# EAGLE design TheBallClock (EAGLE 6.6.0)
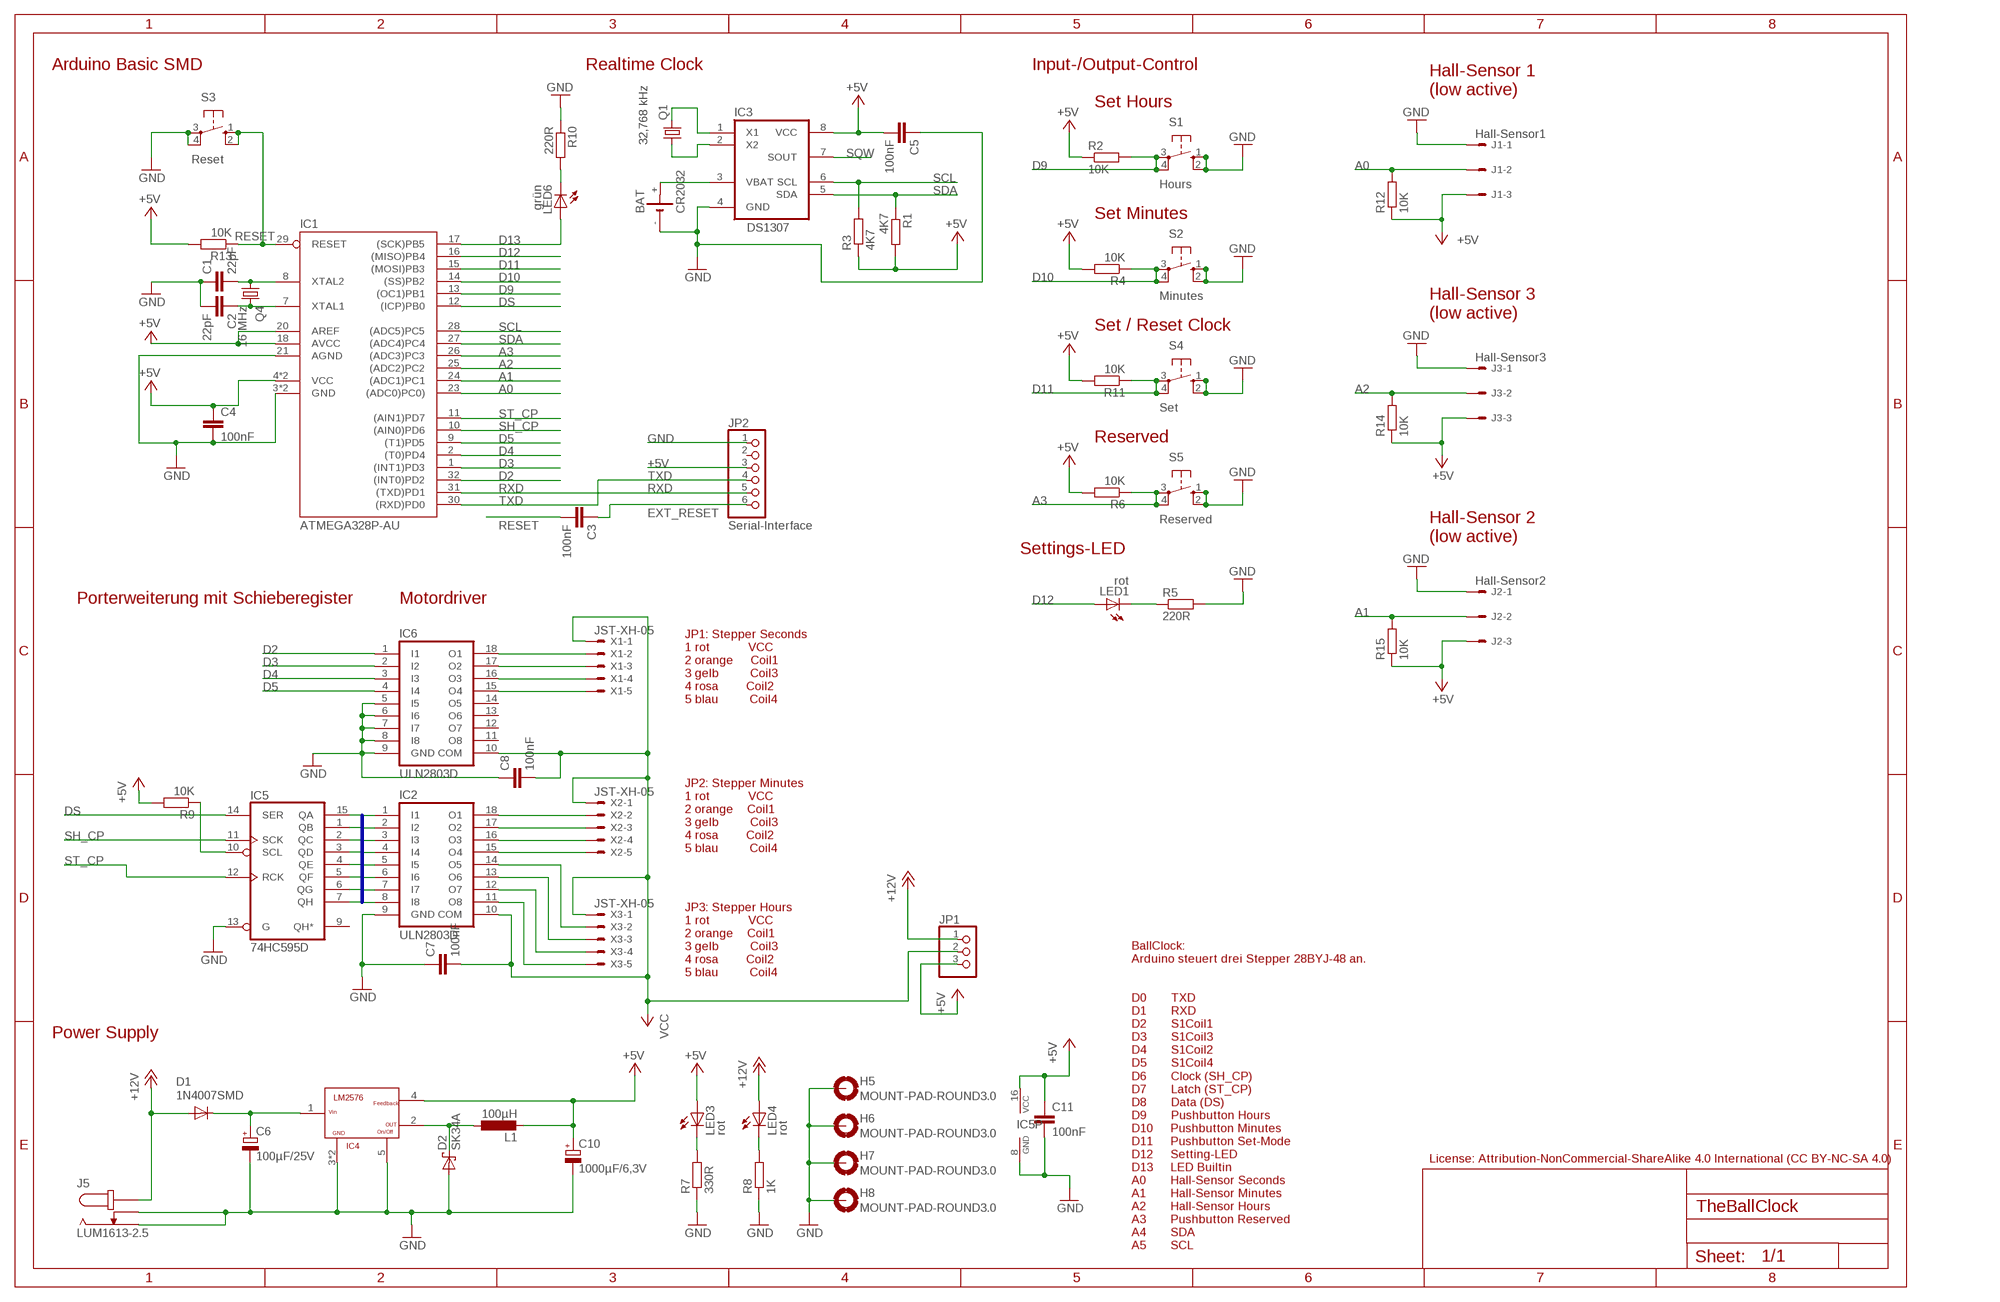
[diagram p0: schematic, sheet 1]

## Parts
BAT  CR2032  BATTERIEHALTER_KZH20  [KZH20-SMD]
C1  22pF  C-EUC0805K  [C0805K]
C2  22pF  C-EUC0805K  [C0805K]
C3  100nF  C-EUC0805  [C0805]
C4  100nF  C-EUC0805  [C0805]
C5  100nF  C-EUC0805  [C0805]
C6  100µF/25V  CPOL-EUF  [PANASONIC_F]
C7  100nF  C-EUC0805  [C0805]
C8  100nF  C-EUC0805  [C0805]
C10  1000µF/6,3V  CPOL-EUG  [PANASONIC_G]
C11  100nF  C-EUC0805  [C0805]
D1  1N4007SMD  DIODE-SMB  [SMB]
D2  SK34A  [DO214AC]
H5  MOUNT-PAD-ROUND3.0  [3,0-PAD]
H6  MOUNT-PAD-ROUND3.0  [3,0-PAD]
H7  MOUNT-PAD-ROUND3.0  [3,0-PAD]
H8  MOUNT-PAD-ROUND3.0  [3,0-PAD]
IC1  ATMEGA328P-AU  [TQFP32-08]
IC2  ULN2803D  [SO18W]
IC3  DS1307  DS1307Z  [SO08]
IC4  LM2576  [TO263-5]
IC5  74HC595D  [SO16]
IC6  ULN2803D  [SO18W]
J1  Hall-Sensor1  22-27-2031-03  [6410-03]
J2  Hall-Sensor2  22-27-2031-03  [6410-03]
J3  Hall-Sensor3  22-27-2031-03  [6410-03]
J5  LUM1613-2.5  [LUM_DS_1613_15]
JP1  PINHD-1X3  [1X03]
JP2  Serial-Interface  PINHD-1X6  [1X06]
L1  100µH  L-EUPISM  [PISM]
LED1  rot  LEDCHIPLED_0805  [CHIPLED_0805]
LED3  rot  LEDCHIPLED_0805  [CHIPLED_0805]
LED4  rot  LEDCHIPLED_0805  [CHIPLED_0805]
LED6  grün  LEDCHIPLED_0805  [CHIPLED_0805]
Q1  32,768 kHz  CRYSTALTC38H  [TC38H]
Q4  16 MHz  CRYSTALHC49UP  [HC49UP]
R1  4K7  R-EU_R0805  [R0805]
R2  10K  R-EU_M0805  [M0805]
R3  4K7  R-EU_R0805  [R0805]
R4  10K  R-EU_M0805  [M0805]
R5  220R  R-EU_R0805  [R0805]
R6  10K  R-EU_M0805  [M0805]
R7  330R  R-EU_R0805  [R0805]
R8  1K  R-EU_R0805  [R0805]
R9  10K  R-EU_R0805  [R0805]
R10  220R  R-EU_R0805  [R0805]
R11  10K  R-EU_M0805  [M0805]
R12  10K  R-EU_M0805  [M0805]
R13  10K  R-EU_M0805  [M0805]
R14  10K  R-EU_M0805  [M0805]
R15  10K  R-EU_M0805  [M0805]
S1  Hours  10-XX  [B3F-10XX]
S2  Minutes  10-XX  [B3F-10XX]
S3  Reset  10-XX  [B3F-10XX]
S4  Set  10-XX  [B3F-10XX]
S5  Reserved  10-XX  [B3F-10XX]
X1  JST-XH-05  JST-XH-05-PIN-LONG-PAD  [JST-XH-05-PACKAGE-LONG-PAD]
X2  JST-XH-05  JST-XH-05-PIN-LONG-PAD  [JST-XH-05-PACKAGE-LONG-PAD]
X3  JST-XH-05  JST-XH-05-PIN-LONG-PAD  [JST-XH-05-PACKAGE-LONG-PAD]

## Nets
+5V [power]: C4.1 C5.2 C10.+ C11.1 IC1.4(VCC) IC1.6(VCC) IC1.18(AVCC) IC1.20(AREF) IC3.8(VCC) IC4.4(FEEDBACK) IC5.16(VCC) J1.3 J2.3 J3.3 JP1.3 JP2.3 L1.2 LED3.A R1.2 R2.1 R3.1 R4.2 R6.2 R9.2 R11.2 R12.1 R13.2 R14.1 R15.1
+12V: D1.A J5.3A J5.3B JP1.1 LED4.A
A0: IC1.23((ADC0)PC0)) J1.2 R12.2
A1: IC1.24((ADC1)PC1) J2.2 R15.2
A2: IC1.25((ADC2)PC2) J3.2 R14.2
A3: IC1.26((ADC3)PC3) R6.1 S5.3(P) S5.4(P1)
BUS1: IC2.1(I1) IC5.15(QA)
BUS2: IC2.2(I2) IC5.1(QB)
BUS3: IC2.3(I3) IC5.2(QC)
BUS4: IC2.4(I4) IC5.3(QD)
BUS5: IC2.5(I5) IC5.4(QE)
BUS6: IC2.6(I6) IC5.5(QF)
BUS7: IC2.7(I7) IC5.6(QG)
BUS8: IC2.8(I8) IC5.7(QH)
D2: IC1.32((INT0)PD2) IC6.1(I1)
D3: IC1.1((INT1)PD3) IC6.2(I2)
D4: IC1.2((T0)PD4) IC6.3(I3)
D5: IC1.9((T1)PD5) IC6.4(I4)
D9: IC1.13((OC1)PB1) R2.2 S1.3(P) S1.4(P1)
D10: IC1.14((SS)PB2) R4.1 S2.3(P) S2.4(P1)
D11: IC1.15((MOSI)PB3) R11.1 S4.3(P) S4.4(P1)
D12: IC1.16((MISO)PB4) LED1.A
D13: IC1.17((SCK)PB5) LED6.A
DS: IC1.12((ICP)PB0) IC5.14(SER)
EXT_RESET: C3.1 JP2.6
GND [gnd]: BAT.- C1.1 C2.2 C4.2 C5.1 C6.- C7.1 C8.1 C10.- C11.2 D2.A H5.B3,0(MOUNT) H6.B3,0(MOUNT) H7.B3,0(MOUNT) H8.B3,0(MOUNT) IC1.3(GND) IC1.5(GND) IC1.21(AGND) IC2.9(GND) IC3.4(GND) IC4.3(GND) IC4.5(ON/OFF) IC4.6(GND) IC5.8(GND) IC5.13(G) IC6.5(I5) IC6.6(I6) IC6.7(I7) IC6.8(I8) IC6.9(GND) J1.1 J2.1 J3.1 J5.1 J5.2 JP2.1 R5.2 R7.1 R8.1 R10.1 S1.1(S) S1.2(S1) S2.1(S) S2.2(S1) S3.3(P) S3.4(P1) S4.1(S) S4.2(S1) S5.1(S) S5.2(S1)
N$1: LED1.C R5.1
N$2: BAT.+ IC3.3(VBAT)
N$3: D2.C IC4.2(OUTPUT) L1.1
N$4: LED3.C R7.2
N$5: LED4.C R8.2
N$6 [power]: C6.+ D1.C IC4.1(+VIN)
N$11: C1.2 IC1.8(XTAL2) Q4.1
N$12: IC2.18(O1) X2.2
N$13: C2.1 IC1.7(XTAL1) Q4.2
N$14: LED6.C R10.2
N$15: IC2.17(O2) X2.3
N$16: IC2.16(O3) X2.4
N$17: IC2.15(O4) X2.5
N$18: IC2.14(O5) X3.2
N$19: IC2.13(O6) X3.3
N$20: IC2.12(O7) X3.4
N$21: IC2.11(O8) X3.5
N$22: IC6.18(O1) X1.2
N$23: IC6.17(O2) X1.3
N$24: IC6.16(O3) X1.4
N$25: IC6.15(O4) X1.5
N$38: IC5.10(SCL) R9.1
N$227: IC3.1(X1) Q1.2
N$228: IC3.2(X2) Q1.1
RESET: C3.2 IC1.29(RESET) R13.1 S3.1(S) S3.2(S1)
RXD: IC1.31((TXD)PD1) JP2.5
SCL: IC1.28((ADC5)PC5) IC3.6(SCL) R3.2
SDA: IC1.27((ADC4)PC4) IC3.5(SDA) R1.1
SH_CP: IC1.10((AIN0)PD6) IC5.11(SCK)
SQW: IC3.7(SOUT)
ST_CP: IC1.11((AIN1)PD7) IC5.12(RCK)
TXD: IC1.30((RXD)PD0) JP2.4
VCC: C7.2 C8.2 IC2.10(COM) IC6.10(COM) JP1.2 X1.1 X2.1 X3.1
Unconnected: IC5.9(QH*) IC6.11(O8) IC6.12(O7) IC6.13(O6) IC6.14(O5) JP2.2

## Buses
BUS[1..8]

## Notes on the sheet
- Arduino Basic SMD | Realtime Clock | Input-/Output-Control
- Hall-Sensor 1
  (low active)
- Set Hours
- Set Minutes
- Hall-Sensor 3
  (low active)
- Set / Reset Clock
- Reserved
- Hall-Sensor 2
  (low active)
- Settings-LED
- Porterweiterung mit Schieberegister | Motordriver
- JP1: Stepper Seconds
  1 rot           VCC
  2 orange     Coil1
  3 gelb         Coil3
  4 rosa        Coil2
  5 blau         Coil4
- JP2: Stepper Minutes
  1 rot           VCC
  2 orange    Coil1
  3 gelb         Coil3
  4 rosa        Coil2
  5 blau         Coil4
- JP3: Stepper Hours
  1 rot           VCC
  2 orange    Coil1
  3 gelb         Coil3
  4 rosa        Coil2
  5 blau         Coil4
- Power Supply
- License: Attribution-NonCommercial-ShareAlike 4.0 International (CC BY-NC-SA 4.0)
- BallClock:
  Arduino steuert drei Stepper 28BYJ-48 an.
  
  
  D0       TXD
  D1       RXD
  D2       S1Coil1
  D3       S1Coil3
  D4       S1Coil2
  D5       S1Coil4
  D6       Clock (SH_CP)
  D7       Latch (ST_CP)
  D8       Data (DS)
  D9       Pushbutton Hours
  D10     Pushbutton Minutes
  D11     Pushbutton Set-Mode
  D12     Setting-LED
  D13     LED Builtin
  A0       Hall-Sensor Seconds
  A1       Hall-Sensor Minutes
  A2       Hall-Sensor Hours
  A3       Pushbutton Reserved     
  A4       SDA
  A5       SCL

## Library data of the parts
BAT = MyEagle_NEW:BATTERIEHALTER_KZH20: KZH 20 Batteriehalter BH KZH-20-1 Reichelt: https://www.reichelt.de/Batteriehalter-fuer-Knopfzellen/KZH-20-1/3/index.html?ACTION=3&LA=2&ARTICLE=44621&GROUPID=4260&artnr=KZH+20-1&SEARCH=%252A
C1-C5 C7 C8 C11 = resistor:C-EU: CAPACITOR, European symbol
C6 C10 = resistor:CPOL-EU: POLARIZED CAPACITOR, European symbol
D1 = diode:DIODE-: DIODE
D2 = MyEagle:SK34A
H5-H8 = holes:MOUNT-PAD-ROUND: MOUNTING PAD, round
IC1 = ATMega328:ATMEGA328P-: MICROCONTROLLER 4 Kbytes FLASH 128 bytes SRAM 256 bytes EEPROM UART 6-channel 10 bit ADC
IC2 IC6 = MyEagle:ULN2803: ULN2803 Darlington Arrays 8 Darlington Arrays
IC3 = MyEagle:DS1307: DS1307 64 x 8 Serial Real Time Clock
IC4 = MyEagle:LM2576: LM2576 3 A Step Down Voltage Regulator Datenblatt: https://www.mikrocontroller.net/part/LM2576
IC5 = 74xx-eu:74*595: 8-bit SHIFT REGISTER, output latch
J1-J3 = con-molex:22-?-03: CONNECTOR wire to board 2.54 mm (.1 inch) pitch header
J5 = MyEagle:LUM1613: Lumberg 1613 Netzgeräte-Einbaukupplung mit Öffner SMD Lumberg 1613-14: Durchmesser aussen: 6,5 mm Durchmesser Mittelstift: 2,0 mm Lumberg 1613-15: Durchmesser aussen: 6,5 mm Durchmesser Mittelstift: 2,5 mm Datenblatt: https://cdn-reichelt.de/documents/datenblatt/C160/DS_1613_14.pdf
JP1 = pinhead:PINHD-1X3: PIN HEADER
JP2 = pinhead:PINHD-1X6: PIN HEADER
L1 = Inductor-Fastron2:L-EU
LED1 LED3 LED4 LED6 = led:LED: LED OSRAM: - CHIPLED LG R971, LG N971, LY N971, LG Q971, LY Q971, LO R971, LY R971 LH N974, LH R974 LS Q976, LO Q976, LY Q976 LO Q996 - Hyper CHIPLED LW Q18S LB Q993, LB Q99A, LB R99A - SideLED LS A670, LO A670, LY A670, LG A670, LP A670 LB A673, LV A673, LT A673, LW A673 LH A674 LY A675 LS A676, LA A676, LO A676, LY A676, LW A676 LS A679, LY A679, LG A679 - Hyper Micro SIDELED® LS Y876, LA Y876, LO Y876, LY Y876 LT Y87S - SmartLED LW L88C, LW L88S LB L89C, LB L89S, LG L890 LS L89K, LO L89K, LY L89K LS L896, LA L896, LO L896, LY L896 - TOPLED LS T670, LO T670, LY T670, LG T670, LP T670 LSG T670, LSP T670, LSY T670, LOP T670, LYG T670 LG T671, LOG T671, LSG T671 LB T673, LV T673, LT T673, LW T673 LH T674 LS T676, LA T676, LO T676, LY T676, LB T676, LH T676, LSB T676, LW T676 LB T67C, LV T67C, LT T67C, LS T67K, LO T67K, LY T67K, LW E67C LS E67B, LA E67B, LO E67B, LY E67B, LB E67C, LV E67C, LT E67C LW T67C LS T679, LY T679, LG T679 LS T770, LO T770, LY T770, LG T770, LP T770 LB T773, LV T773, LT T773, LW T773 LH T774 LS E675, LA E675, LY E675, LS T675 LS T776, LA T776, LO T776, LY T776, LB T776 LHGB T686 LT T68C, LB T68C - Hyper Mini TOPLED® LB M676 - Mini TOPLED Santana® LG M470 LS M47K, LO M47K, LY M47K Source: http://www.osram.convergy.de LUXEON: - LUMILED® LXK2-PW12-R00, LXK2-PW12-S00, LXK2-PW14-U00, LXK2-PW14-V00 LXK2-PM12-R00, LXK2-PM12-S00, LXK2-PM14-U00 LXK2-PE12-Q00, LXK2-PE12-R00, LXK2-PE12-S00, LXK2-PE14-T00, LXK2-PE14-U00 LXK2-PB12-K00, LXK2-PB12-L00, LXK2-PB12-M00, LXK2-PB14-N00, LXK2-PB14-P00, LXK2-PB14-Q00 LXK2-PR12-L00, LXK2-PR12-M00, LXK2-PR14-Q00, LXK2-PR14-R00 LXK2-PD12-Q00, LXK2-PD12-R00, LXK2-PD12-S00 LXK2-PH12-R00, LXK2-PH12-S00 LXK2-PL12-P00, LXK2-PL12-Q00, LXK2-PL12-R00 Source: www.luxeon.com KINGBRIGHT: KA-3528ASYC Source: www.kingbright.com
Q1 = MyEagle:CRYSTAL: CRYSTAL; OC_FARNELL: unknown; OC_NEWARK: unknown
Q4 = crystal:CRYSTAL: CRYSTAL; OC_FARNELL: unknown; OC_NEWARK: unknown
R1-R15 = resistor:R-EU_: RESISTOR, European symbol
S1-S5 = switch-omron:10-XX: OMRON SWITCH; MPN: B3F-1000; OC_FARNELL: 176432; OC_NEWARK: 36M3542
X1-X3 = con-jst XH Connectors v1-0:JST-XH-05-PIN: JST XH Connector 2 Pin Wire to board connector. Pitch: 2,54 mm, (0.100") Number of pins: 5 Created by Rembrandt Electronics www.rembrandtelectronics.com

## Net classes
1 power: width 0.61 mm, drill 0.61 mm, clearance 0.254 mm
2 gnd: width 0.61 mm, drill 0.559 mm, clearance 0.254 mm

## Board
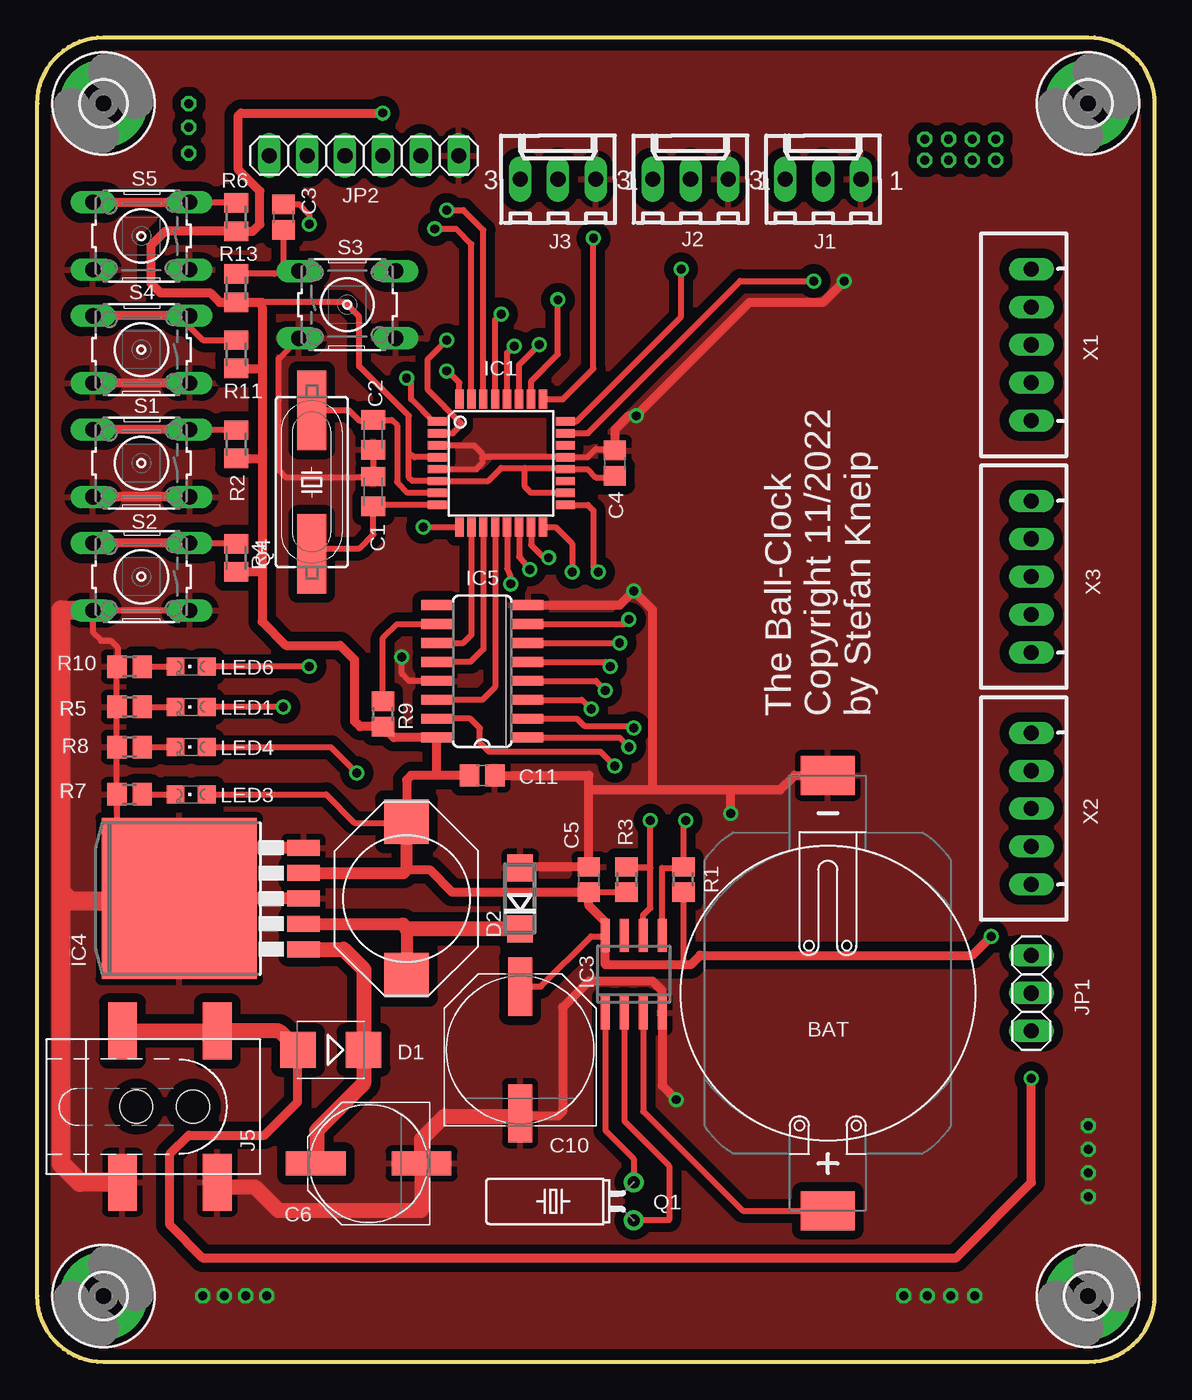
[diagram p1: board, top side]
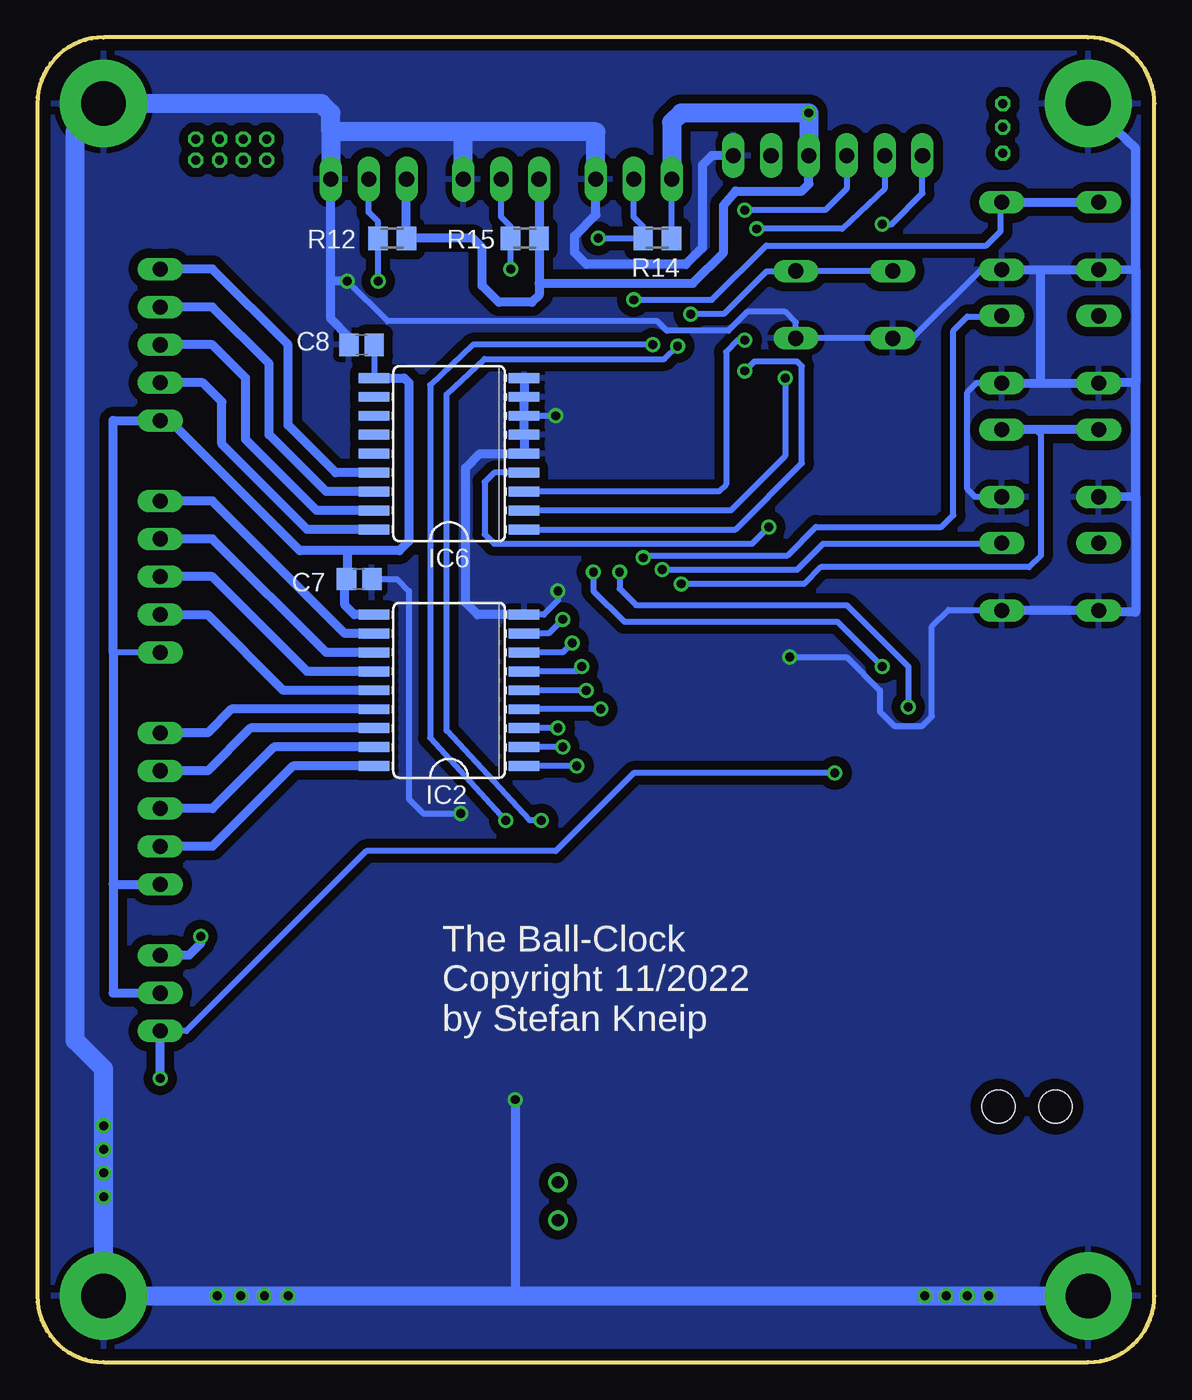
[diagram p2: board, bottom side, seen from below]

Size 74.93 x 88.9 mm. Coordinates in mm from the lower left corner, seen from the top.
Outline: 4.45,88.9 70.49,88.9 arc-90 74.93,84.45 74.93,4.45 arc-90 70.49,0 4.45,0 arc-90 0,4.45 0,84.45 arc-90 4.45,88.9
Copper layers (1*16): Top 0.035mm / dielectric 1.5mm / Bottom 0.035mm
Design rules "default *": minimum track width 16mil, minimum drill 24mil, track to track 24mil, track to pad 24mil, pad to pad 24mil, via to via 24mil, smd to smd 24mil, copper to edge 30mil, drill to drill 30mil, minimum pad ring 10mil, minimum via ring 8mil, stop-mask expansion 4mil, vias tented up to drill 0mil, thermal gap 16mil

### Footprints (pad centres in the part's own frame; a part is rotated, then mirrored left to right if it is on the bottom)
KZH20-SMD = smd 3.6 x 2.6: + 0,15.24; - 0,-13.97
C0805K = smd 1.3 x 1.6: 1 -1,0; 2 1,0
C0805 = smd 1.3 x 1.5: 1 -0.85,0; 2 0.85,0
PANASONIC_F = smd 4 x 1.6: + 3.55,0; - -3.55,0
PANASONIC_G = smd 3.9 x 1.6: + 4.25,0; - -4.25,0
SMB = smd 2.4 x 2.4: A 2.2,0; C -2.2,0
DO214AC = smd 1.8 x 1.7: A 2.05,0; C -2.05,0
3,0-PAD = drill 3 pad 5.842: B3,0 0,0
TQFP32-08 = smd 1.27 x 0.559: 1 -4.293,2.8; 2 -4.293,2; 3 -4.293,1.2; 4 -4.293,0.4; 5 -4.293,-0.4; 6 -4.293,-1.2; 7 -4.293,-2; 8 -4.293,-2.8; 17 4.293,-2.8; 18 4.293,-2; 19 4.293,-1.2; 20 4.293,-0.4; 21 4.293,0.4; 22 4.293,1.2; 23 4.293,2; 24 4.293,2.8 | smd 0.559 x 1.27: 9 -2.8,-4.293; 10 -2,-4.293; 11 -1.2,-4.293; 12 -0.4,-4.293; 13 0.4,-4.293; 14 1.2,-4.293; 15 2,-4.293; 16 2.8,-4.293; 25 2.8,4.293; 26 2,4.293; 27 1.2,4.293; 28 0.4,4.293; 29 -0.4,4.293; 30 -1.2,4.293; 31 -2,4.293; 32 -2.8,4.293
SO18W = smd 0.66 x 2.032: 1 -5.08,-5.029; 2 -3.81,-5.029; 3 -2.54,-5.029; 4 -1.27,-5.029; 5 0,-5.029; 6 1.27,-5.029; 7 2.54,-5.029; 8 3.81,-5.029; 9 5.08,-5.029; 10 5.08,5.029; 11 3.81,5.029; 12 2.54,5.029; 13 1.27,5.029; 14 0,5.029; 15 -1.27,5.029; 16 -2.54,5.029; 17 -3.81,5.029; 18 -5.08,5.029
SO08 = smd 0.6 x 2.2: 1 -1.905,-2.6; 2 -0.635,-2.6; 3 0.635,-2.6; 4 1.905,-2.6; 5 1.905,2.6; 6 0.635,2.6; 7 -0.635,2.6; 8 -1.905,2.6
TO263-5 = smd 1.067 x 2.159: 1 -3.404,-5.791; 2 -1.702,-5.791; 3 0,-5.791; 4 1.702,-5.791; 5 3.404,-5.791 | smd 10.8 x 10.41: 6 0,2.54
SO16 = smd 0.66 x 2.032: 1 -4.445,-3.073; 2 -3.175,-3.073; 3 -1.905,-3.073; 4 -0.635,-3.073; 5 0.635,-3.073; 6 1.905,-3.073; 7 3.175,-3.073; 8 4.445,-3.073; 9 4.445,3.073; 10 3.175,3.073; 11 1.905,3.073; 12 0.635,3.073; 13 -0.635,3.073; 14 -1.905,3.073; 15 -3.175,3.073; 16 -4.445,3.073
6410-03 = drill 1.016 long: 1 2.54,0; 2 0,0; 3 -2.54,0
LUM_DS_1613_15 = smd 1.93 x 3.81: 1 -2.54,-5.08; 2 3.81,-5.08; 3A 3.81,5.08; 3B -2.54,5.08 | hole 2.2: -1.613,0.002; 2.197,0.002
1X03 = drill 1.016 long: 1 -2.54,0; 2 0,0; 3 2.54,0
1X06 = drill 1.016 long: 1 -6.35,0; 2 -3.81,0; 3 -1.27,0; 4 1.27,0; 5 3.81,0; 6 6.35,0
PISM = smd 3 x 3: 1 -5.15,0; 2 5.15,0
CHIPLED_0805 = smd 1.2 x 1.2: A 0,-1.05; C 0,1.05
TC38H = drill 0.813: 1 -1.27,0; 2 1.27,0
HC49UP = smd 5.334 x 1.93: 1 -4.826,0; 2 4.826,0
R0805 = smd 1.3 x 1.5: 1 -0.85,0; 2 0.85,0
M0805 = smd 1.3 x 1.6: 1 -0.95,0; 2 0.95,0
B3F-10XX = drill 1.016 long: 1 -3.251,2.261; 2 3.251,2.261; 3 -3.251,-2.261; 4 3.251,-2.261
JST-XH-05-PACKAGE-LONG-PAD = drill 1.016 long: 1 -5.08,0; 2 -2.54,0; 3 0,0; 4 2.54,0; 5 5.08,0

### Placement (x,y rotation side)
BAT  53.02,25.4 180 top
C1  22.54,58.42 270 top
C2  22.54,62.23 270 top
C3  16.51,76.83 270 top
C4  38.73,60.33 90 top
C5  36.99,32.39 270 top
C6  22.23,13.34 180 top
C7  53.34,52.55 180 bottom
C8  53.18,68.26 0 bottom
C10  32.38,20.96 90 top
C11  29.84,39.37 0 top
D1  19.68,20.96 180 top
D2  32.38,31.11 90 top
H5  70.48,4.45 0 top
H6  4.45,4.45 0 top
H7  4.45,84.45 0 top
H8  70.48,84.45 0 top
IC1  31.12,60.33 0 top
IC2  47.31,45.08 90 bottom
IC3  40.01,26.04 0 top
IC4  12.06,31.11 90 top
IC5  29.84,46.36 90 top
IC6  47.31,60.96 90 bottom
J1  52.7,79.38 0 top
J2  43.81,79.38 0 top
J3  34.92,79.38 0 top
J5  8.26,17.14 0 top
JP1  66.67,24.77 90 top
JP2  21.91,80.96 180 top
L1  24.77,31.11 90 top
LED1  10.32,43.97 90 top
LED3  10.32,38.1 90 top
LED4  10.32,41.28 90 top
LED6  10.32,46.67 90 top
Q1  40.01,10.8 90 top
Q4  18.41,59.05 90 top
R1  43.34,32.39 270 top
R2  13.34,61.59 90 top
R3  39.53,32.39 90 top
R4  13.34,53.97 270 top
R5  6.19,43.97 180 top
R6  13.34,76.83 270 top
R7  6.19,38.1 0 top
R8  6.19,41.28 0 top
R9  23.18,43.5 270 top
R10  6.19,46.67 0 top
R11  13.34,67.63 270 top
R12  51.12,75.41 180 bottom
R13  13.34,72.07 270 top
R14  33.34,75.41 180 bottom
R15  42.23,75.41 180 bottom
S1  6.98,60.33 180 top
S2  6.98,52.7 180 top
S3  20.8,70.96 0 top
S4  6.98,67.94 180 top
S5  6.98,75.56 180 top
X1  66.67,68.26 90 top
X2  66.67,37.15 90 top
X3  66.67,52.7 90 top

### Tracks (layer width: path | path; a pad name or v marks a point on that pad's centre or on a via)
+5V  (via drill 0.6)
  Top 0.406: 32.7,60.01 31.12,60.01 30.23,59.12 IC1.6 25.17,59.12 24.92,59.37 24.92,60.96 | 32.7,60.01 35.33,60.01 IC1.20 36.91,59.92 37.47,59.37 38.63,59.37 C4.1 | IC1.18 33.12,58.33 32.7,58.74 32.7,60.01 | C10.+ 33.78,25.21 37.15,28.57 37.94,28.57 | 37.94,28.57 38.04,28.57 IC3.8 | 24.65,33.02 24.45,32.82 | L1.2 24.7,36.19 21.27,36.19 19.37,38.1 LED3.A | 24.92,60.96 24.92,63.5 21.59,66.83 21.59,70.17 20.64,71.12 14.13,71.12 R13.2 | IC1.4 25.32,60.72 24.92,60.96 | 15.08,71.12 15.08,70.8 | R4.2 | 14.92,66.68 15.08,66.52 | 15.08,60.64 | 43.18,26.67 43.34,26.83 R1.2 | 37.94,28.57 38.1,28.73 | 26.77,39.43 26.83,39.37 | 13.49,83.66 13.65,83.82 | R3.1 C5.2
  Top 0.61: IC3.8 38.1,26.67 43.18,26.67 43.81,26.67 44.45,27.31 62.71,27.31 v63.98,28.57 | 24.65,33.02 26.35,33.02 27.84,31.54 C5.2 36.99,30.64 38.1,29.53 38.1,28.73 | 14.13,71.12 15.08,71.12 | 15.08,70.8 15.08,66.52 15.08,60.64 15.08,53.02 | 15.08,53.02 R4.2 | R11.2 14.92,66.68 | R2.1 15.08,60.64 | R13.2 12.22,71.12 11.59,71.75 8.26,71.75 7.62,72.39 7.62,74.93 8.58,75.88 R6.2 14.45,75.88 14.92,76.36 14.92,78.58 13.49,80.01 13.49,83.66 | C11.1 26.83,39.37 25.08,39.37 24.77,39.05 L1.2 | 26.77,39.43 IC5.16 23.91,41.91 R9.2 21.65,42.65 21.27,43.02 21.27,47.15 20.32,48.1 16.67,48.1 15.08,49.69 15.08,53.02 | 13.65,83.82 v23.18,83.82
  Top 0.813: IC4.4 24.45,32.82 24.56,32.82 24.77,33.02 L1.2
  Bottom 0.406: R14.1 J3.3 | J2.3 R15.1 41.28,72.39 | J1.3
  Bottom 0.61: J1.3 R12.1 45.72,75.41 45.09,74.77 45.09,72.23 43.97,71.12 41.75,71.12 41.27,71.6 J2.3 | 41.28,72.39 39.85,72.39 30.96,72.39 28.89,74.45 28.89,77.63 28.1,78.58 23.65,78.58 23.18,79.06 JP2.3 | v63.98,28.57 63.98,28.1 64.77,27.31 JP1.3
  Bottom 1.27: J3.3 32.38,83.19 31.75,83.82 v23.18,83.82 JP2.3
+12V  (via drill 0.6)
  Top 0.406: 17.46,20.93 D1.A | LED4.A 19.68,41.28 v21.43,39.53
  Top 0.61: 17.46,20.93 17.46,17.46 15.24,15.24 10.16,15.24 8.89,13.97 8.89,9.21 11.11,6.98 61.6,6.98 66.68,12.07 v66.68,19.05
  Top 1.016: D1.A 16.21,22.23 J5.3A J5.3B
  Bottom 0.406: v21.43,39.53 34.92,39.53 40.16,34.29 52.86,34.29 64.93,22.23 JP1.1
  Bottom 0.61: v66.68,19.05 JP1.1
A0  (via drill 0.6)
  Top 0.406: IC1.23 36.92,62.33 47.15,72.55 v52.07,72.55
  Bottom 0.406: J1.2 52.7,77.15 52.07,76.52 R12.2 52.07,74.93 v52.07,72.55
A1  (via drill 0.6)
  Top 0.406: IC1.24 36.14,63.12 43.18,70.17 v43.18,73.34
  Bottom 0.406: J2.2 43.81,76.83 43.18,76.2 R15.2 43.18,74.93 v43.18,73.34
A2  (via drill 0.6)
  Top 0.406: IC1.25 35.25,64.62 37.31,66.67 v37.31,75.41
  Bottom 0.406: J3.2 34.92,76.83 34.29,76.2 R14.2 v37.31,75.41
A3  (via drill 0.6)
  Top 0.406: R6.1 10.28,77.78 S5.3 | IC1.26 33.12,65.82 34.92,67.63 v34.92,71.28
  Top 0.61: S5.4 10.32,77.83 10.32,77.79
  Bottom 0.406: v34.92,71.28 29.69,71.28 26.03,74.93 11.27,74.93 10.32,75.88 10.32,77.74 S5.3
  Bottom 0.61: S5.3 S5.4
BUS1  (via drill 0.6)
  Top 0.406: v38.73,40 37.78,40.96 30.32,40.96 29.69,41.59 29.69,42.55 29.05,43.18 IC5.15
  Bottom 0.406: v38.73,40 IC2.1
BUS2  (via drill 0.6)
  Top 0.406: IC5.1 39.05,41.91 v39.69,41.28
  Bottom 0.406: v39.69,41.28 IC2.2
BUS3  (via drill 0.6)
  Top 0.406: IC5.2 36.2,43.18 36.67,42.7 39.85,42.7 v40.01,42.55
  Bottom 0.406: v40.01,42.55 IC2.3
BUS4  (via drill 0.6)
  Top 0.406: IC5.3 36.51,44.45 v37.15,43.81
  Bottom 0.406: v37.15,43.81 IC2.4
BUS5  (via drill 0.6)
  Top 0.406: IC5.4 37.47,45.72 v38.1,45.08
  Bottom 0.406: v38.1,45.08 IC2.5
BUS6  (via drill 0.6)
  Top 0.406: IC5.5 38.1,46.99 v38.42,46.67
  Bottom 0.406: v38.42,46.67 38.73,46.36 IC2.6
BUS7  (via drill 0.6)
  Top 0.406: IC5.6 v39.05,48.26
  Bottom 0.406: v39.05,48.26 39.69,47.62 IC2.7
BUS8  (via drill 0.6)
  Top 0.406: IC5.7 39.37,49.53 v39.69,49.85
  Bottom 0.406: v39.69,49.85 40.64,48.89 IC2.8
D2  (via drill 0.6)
  Top 0.406: IC1.32 28.32,65.72 27.52,66.52 v27.46,66.52
  Bottom 0.406: IC6.1 28.1,55.88 23.65,60.33 23.65,66.83 23.97,67.15 26.83,67.15 v27.46,66.52
D3  (via drill 0.6)
  Top 0.406: IC1.1 26.57,63.12 25.08,64.61 25.08,65.72 v24.77,66.04
  Bottom 0.406: v24.77,66.04 24.77,60.8 28.42,57.15 IC6.2
D4  (via drill 0.6)
  Top 0.406: IC1.2 27.88,62.33 28.42,62.86 28.42,63.02 26.19,65.25 26.19,67.31 v27.46,68.58
  Bottom 0.406: v27.46,68.58 27.94,68.58 28.73,67.79 28.73,58.9 29.21,58.42 IC6.3
D5  (via drill 0.6)
  Top 0.406: v25.88,56.04 IC1.9
  Bottom 0.406: IC6.4 44.29,59.69 44.93,59.05 44.93,55.56 44.29,54.93 26.99,54.93 v25.88,56.04
D9  (via drill 0.6)
  Top 0.406: S1.3 13.29,62.59 R2.2 | IC1.13 31.52,53.26 31.75,52.7 v31.75,52.23
  Top 0.61: S1.3 S1.4
  Bottom 0.406: S1.3 7.98,62.59 7.62,62.23 7.62,54.13 8.41,53.34 22.38,53.34 23.5,52.23 v31.75,52.23
  Bottom 0.61: S1.4 S1.3
D10  (via drill 0.6)
  Top 0.406: S2.3 13.29,54.97 R4.1 | IC1.14 32.31,54.05 v33.02,53.18
  Top 0.61: S2.3 S2.4
  Bottom 0.406: v33.02,53.18 23.97,53.18 22.23,54.93 10.27,54.93 S2.3
D11  (via drill 0.6)
  Top 0.406: S4.3 10.24,69.46 11.11,68.58 R11.1 | IC1.15 33.12,54.83 33.97,53.97 v34.29,53.97
  Top 0.61: S4.3 S4.4
  Bottom 0.406: v34.29,53.97 33.97,54.13 24.61,54.13 22.7,56.04 14.29,56.04 13.49,56.83 13.49,69.22 12.54,70.17 10.27,70.17 S4.3
D12  (via drill 0.6)
  Top 0.406: IC1.16 34.77,56.03 35.88,54.93 v35.88,53.02 | v16.51,43.97 LED1.A
  Bottom 0.406: v35.88,53.02 35.88,51.91 34.77,50.8 20.64,50.8 16.51,46.67 v16.51,43.97
D13  (via drill 0.6)
  Top 0.406: IC1.17 36.93,57.53 37.31,57.15 37.31,53.34 v37.62,53.02 | v18.26,46.67 LED6.A
  Bottom 0.406: v37.62,53.02 37.62,51.75 35.56,49.69 21.27,49.69 v18.26,46.67
DS
  Top 0.406: IC1.12 30.72,45.32 29.84,44.45 IC5.14
EXT_RESET  (via drill 0.6)
  Top 0.406: C3.1 17.57,77.69 18.26,76.99 v18.26,76.36
  Bottom 0.406: v18.26,76.36 17.62,76.36 15.56,78.42 JP2.6
GND  (via drill 0.6)
  Top 0.406: IC1.5 29.45,59.92 29.84,60.33 29.84,60.64 | IC1.3 29.28,61.52 29.84,60.96 29.84,60.64 | 29.84,60.64 29.93,60.72 IC1.21 36.91,60.72 37.47,61.28 38.63,61.28 C4.2 | 32.58,16.51 C10.- | 32.45,33.23 D2.A | IC4.6 7.14,31.11 5.34,32.92 R7.1 R8.1 R5.2 R10.1 5.4,46.73 5.4,47.94 4.92,48.42 4.29,48.42 3.73,48.97 S2.2 S2.1 | 25.08,45.72 IC5.13 24.92,45.72 24.45,46.2 v24.45,47.31 | C2.2 C1.1 22.54,59.37 16.67,59.37 16.19,59.85 16.19,67.35 S3.3 | v40.16,63.5 39.69,63.5
  Top 0.61: 32.58,16.51 34.92,16.51 35.24,16.83 35.24,23.81 36.99,25.56 41.27,25.56 41.91,24.92 IC3.4 41.91,18.57 v42.86,17.62 | IC5.8 39.05,50.8 v40.01,51.75 41.27,50.48 41.27,38.42 | 36.99,38.42 41.27,38.42 | 41.27,38.42 46.51,38.42 | 46.51,38.42 49.85,38.42 50.8,39.37 BAT.- | 36.99,38.42 C5.1 32.45,33.23 | 36.99,38.42 36.99,39.37 C11.2 | v46.51,36.83 46.51,38.42 | 39.69,63.5 38.73,62.55 C4.2 | v40.16,63.5 47.78,71.12 52.7,71.12 v54.13,72.55 | 13.72,34.52 10.32,31.11 | 3.65,65.72 v3.7,65.72 10.16,65.72 | S1.1 3.85,58.06 3.81,58.1 10.32,58.1
  Top 0.813: IC4.3 10.32,31.11 IC4.6 | 32.19,16.51 C10.- | 25.77,10.22 25.72,10.16 | 12.38,11.75 J5.2 | IC4.5 13.72,34.52
  Top 1.016: 32.19,16.51 27.3,16.51 25.77,14.98 C6.- 25.77,10.22 | 25.72,10.16 16.19,10.16 14.61,11.75 12.38,11.75
  Top 1.27: S2.2 1.63,50.44 1.59,50.48 1.59,31.59 | 1.59,31.59 2.22,30.96 11.27,30.96 | J5.1 2.86,12.07 1.59,13.34 1.59,31.59
  Bottom 0.406: v40.01,51.75 40.01,51.12 40.96,50.17 IC2.9 | 46.46,79.27 J2.1 | S5.1 10.27,73.34 11.59,73.34 16.23,68.7 S3.3 S3.4 24.05,69.77 24.77,70.48 27.3,70.48 28.58,69.22 32.7,69.22 33.34,69.85 51.44,69.85 v54.13,72.55 | S1.1 12.03,58.06 12.54,58.58 12.54,65.09 11.91,65.72 10.27,65.72 S4.1 7.66,65.68 7.62,65.72 | v24.45,47.31 20.64,47.31 18.41,45.08 18.41,43.66 17.46,42.7 15.56,42.7 14.92,43.34 14.92,49.37 13.81,50.48 10.27,50.48 S2.1 | 3.61,50.32 S2.2 | S1.2 3.53,58.06 | v3.7,65.72 S4.2 | S5.2 3.69,73.3 | C7.1 50.8,52.55 50.01,51.75 50.01,37.78 49.05,36.83 v46.51,36.83 | IC6.7 v40.16,63.5
  Bottom 0.61: IC6.9 IC6.8 IC6.7 IC6.6 IC6.5 45.24,60.96 46.2,60.01 46.2,50.96 45.4,50.17 IC2.9 | JP2.1 29.69,80.96 30.32,80.33 30.32,74.77 31.43,73.66 38.1,73.66 38.89,74.45 38.89,75.56 37.47,76.99 J3.1 | C8.1 54.03,68.8 55.24,70.01 55.24,72.55 | 55.24,72.55 J1.1 | S5.1 7.62,73.3 | 7.62,73.3 S5.2 | S4.1 S4.2 | 7.62,65.72 7.62,73.3 | 1.27,58.1 1.27,50.32 3.61,50.32 | 3.53,58.06 1.27,58.1 | 1.27,58.1 1.27,65.72 | 1.27,65.72 v3.7,65.72 | 3.69,73.3 1.27,73.34 | 1.27,73.34 1.27,65.72 | 1.27,73.34 1.27,81.44 H7.B3,0 | v54.13,72.55 55.24,72.55 | v42.86,17.62 42.86,4.45 | S2.2 S2.1
  Bottom 1.27: J2.1 46.35,82.55 | 46.35,82.55 55.24,82.55 | 55.24,82.55 J1.1 | J3.1 37.47,82.55 46.35,82.55 | 55.24,82.55 55.24,83.82 55.88,84.45 H8.B3,0 72.39,82.55 72.39,21.59 70.49,19.68 v70.49,15.88 v70.49,14.29 v70.49,12.7 v70.49,11.11 H5.B3,0 v62.87,4.45 v61.28,4.45 v59.69,4.45 v58.1,4.45 42.86,4.45 v15.4,4.45 v13.97,4.45 v12.54,4.45 v11.11,4.45 H6.B3,0
  pour Top: 0,88.9 74.77,88.9 74.77,0 0,0
  pour Bottom: 0,1.59 0,87.95 74.93,88.9 74.93,0.16 1.43,0.16
N$1
  Top 0.406: R5.1 LED1.C
N$2
  Top 0.406: IC3.3 40.64,16.83 47.31,10.16 BAT.+
N$3
  Top 0.813: IC4.2 24.45,29.41 | 24.45,29.41 24.56,29.41 24.77,29.21 L1.1 | 24.8,29.07 24.45,29.41
  Top 1.016: D2.C 24.8,29.07
N$4
  Top 0.406: R7.2 LED3.C
N$5
  Top 0.406: R8.2 LED4.C
N$6
  Top 0.813: 21.91,20.98 D1.C | 18.73,13.39 C6.+
  Top 1.016: 21.91,20.98 21.91,26.35 20.55,27.71 IC4.1 | D1.C 21.89,18.71 18.73,15.56 18.73,13.39
N$11
  Top 0.406: C1.2 22.81,57.42 | Q4.1 18.41,54.93 18.73,54.61 21.59,54.61 22.54,55.56 C1.2 | IC1.8 22.65,57.53 C1.2
N$12
  Bottom 0.61: IC2.18 57.79,40 63.18,34.61 X2.2
N$13
  Top 0.406: Q4.2 20.89,63.88 21.59,63.18 22.5,63.18 C2.1 23.77,63.23 24.13,62.86 24.13,59.05 24.86,58.33 IC1.7
N$14
  Top 0.406: R10.2 LED6.C
N$15
  Bottom 0.61: IC2.17 59.05,41.28 63.18,37.15 X2.3
N$16
  Bottom 0.61: IC2.16 60.64,42.55 63.5,39.69 X2.4
N$17
  Bottom 0.61: IC2.15 61.91,43.81 63.5,42.23 X2.5
N$18
  Bottom 0.61: IC2.14 58.42,45.08 63.5,50.17 X3.2
N$19
  Bottom 0.61: IC2.13 56.83,46.36 63.18,52.7 X3.3
N$20
  Bottom 0.61: IC2.12 55.56,47.62 63.18,55.25 X3.4
N$21
  Bottom 0.61: IC2.11 54.29,48.89 63.18,57.78 X3.5
N$22
  Bottom 0.61: IC6.18 56.83,55.88 62.55,61.59 62.55,64.45 63.82,65.72 X1.2
N$23
  Bottom 0.61: IC6.17 56.2,57.15 60.96,61.91 60.96,66.04 63.18,68.26 X1.3
N$24
  Bottom 0.61: IC6.16 55.56,58.42 59.37,62.23 59.37,66.99 63.18,70.8 X1.4
N$25
  Bottom 0.61: IC6.15 54.93,59.69 58.1,62.86 58.1,68.26 63.18,73.34 X1.5
N$38
  Top 0.406: R9.1 23.18,48.58 24.13,49.53 IC5.10
N$227
  Top 0.406: IC3.1 38.1,15.56 40.01,13.65 Q1.2
N$228
  Top 0.406: IC3.2 39.37,16.19 42.39,13.18 42.39,9.53 Q1.1
RESET  (via drill 0.6)
  Top 0.406: R13.1 15.87,73.02 16.2,73.03 | S3.1 17.42,73.06 16.2,73.03 | IC1.29 30.72,69.93 v31.12,70.33 | C3.2 16.51,73.04 16.2,73.03
  Bottom 0.406: v31.12,70.33 28.89,70.33 26.03,73.18 24.17,73.18 S3.2 S3.1
RXD  (via drill 0.6)
  Top 0.406: IC1.31 29.12,75.02 28.1,76.04 v26.67,76.04
  Bottom 0.406: JP2.5 18.1,78.74 20.96,76.04 v26.67,76.04 26.83,76.04
S$1  (via drill 0.6)
  other vias: 59.53,82.07
S$2  (via drill 0.6)
  other vias: 61.12,82.07
S$3  (via drill 0.6)
  other vias: 62.71,82.07
S$4  (via drill 0.6)
  other vias: 64.29,82.07
S$5  (via drill 0.6)
  other vias: 64.29,80.64
S$6  (via drill 0.6)
  other vias: 62.71,80.64
S$7  (via drill 0.6)
  other vias: 61.12,80.64
S$8  (via drill 0.6)
  other vias: 59.53,80.64
S$9  (via drill 0.6)
  other vias: 10.16,84.45
S$10  (via drill 0.6)
  other vias: 10.16,82.87
S$11  (via drill 0.6)
  other vias: 10.16,81.12
SCL  (via drill 0.6)
  Top 0.406: IC1.28 31.52,67.71 v31.99,68.18 32.07,68.26 | IC3.6 40.64,30 41.12,30.48 41.12,33.18 | 41.12,33.18 39.59,33.18 R3.2 41.06,33.23 41.12,33.18 | 41.12,33.18 v41.12,36.35
  Bottom 0.406: v41.12,36.35 41.91,36.35 47.47,42.39 47.47,64.93 44.93,67.31 32.86,67.31 v31.99,68.18
SDA  (via drill 0.6)
  Top 0.406: IC3.5 41.91,33.18 43.28,33.18 R1.1 43.34,36.19 v43.5,36.35 | IC1.27 32.31,66.92 v33.66,68.26
  Bottom 0.406: v33.66,68.26 45.72,68.26 48.58,65.56 48.58,41.91 v43.5,36.35
SH_CP
  Top 0.406: IC1.10 29.12,48.8 28.58,48.26 IC5.11
ST_CP
  Top 0.406: IC1.11 29.91,47.85 29.05,46.99 IC5.12
TXD  (via drill 0.6)
  Top 0.406: IC1.30 29.91,75.97 28.58,77.31 v27.46,77.31
  Bottom 0.406: JP2.4 20.64,78.74 22.07,77.31 v27.46,77.31
VCC
  Bottom 0.406: X3.1 69.85,47.62 | C8.2 IC6.10 | 54.13,52.6 C7.2 54.29,52.44
  Bottom 0.61: 69.85,32.07 69.85,47.62 69.85,63.18 X1.1 66.04,63.18 57.31,54.45 54.13,54.45 | 69.85,32.07 X2.1 | IC6.10 50.32,66.04 50.01,65.72 50.01,55.09 50.64,54.45 54.13,54.45 | 54.13,54.45 54.13,52.6 | IC2.10 53.66,50.17 54.29,50.8 54.29,52.44 | 69.85,32.07 69.85,24.77 JP1.2

### Text on the board
tNames: The Ball-Clock / Copyright 11/2022 / by Stefan Kneip
bNames: The Ball-Clock / Copyright 11/2022 / by Stefan Kneip